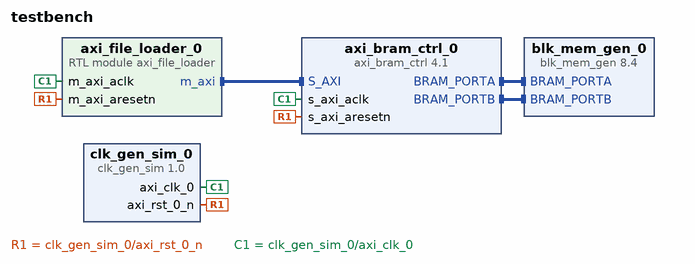
[diagram p0: block diagram of the top level]
# Vivado block design testbench, xc7vx690tffg1927-2, Vivado 2019.1
create_bd_design testbench

create_bd_cell -type ip -vlnv xilinx.com:ip:clk_gen_sim:1.0 clk_gen_sim_0
create_bd_cell -type ip -vlnv xilinx.com:ip:axi_bram_ctrl:4.1 axi_bram_ctrl_0
set_property -dict {CONFIG.DATA_WIDTH 256} [get_bd_cells axi_bram_ctrl_0]
create_bd_cell -type ip -vlnv xilinx.com:ip:blk_mem_gen:8.4 blk_mem_gen_0
set_property -dict [list \
  CONFIG.Enable_B Use_ENB_Pin \
  CONFIG.Memory_Type True_Dual_Port_RAM \
  CONFIG.Port_B_Clock 100 \
  CONFIG.Port_B_Enable_Rate 100 \
  CONFIG.Port_B_Write_Rate 50 \
  CONFIG.Use_RSTB_Pin true \
] [get_bd_cells blk_mem_gen_0]
create_bd_cell -type module -reference axi_file_loader axi_file_loader_0

# ---- connections ----

connect_bd_intf_net [get_bd_intf_pins axi_bram_ctrl_0/BRAM_PORTA] [get_bd_intf_pins blk_mem_gen_0/BRAM_PORTA]
connect_bd_intf_net [get_bd_intf_pins axi_file_loader_0/m_axi] [get_bd_intf_pins axi_bram_ctrl_0/S_AXI]
connect_bd_intf_net [get_bd_intf_pins axi_bram_ctrl_0/BRAM_PORTB] [get_bd_intf_pins blk_mem_gen_0/BRAM_PORTB]
connect_bd_net [get_bd_pins clk_gen_sim_0/axi_rst_0_n] [get_bd_pins axi_bram_ctrl_0/s_axi_aresetn] [get_bd_pins axi_file_loader_0/m_axi_aresetn]
connect_bd_net [get_bd_pins clk_gen_sim_0/axi_clk_0] [get_bd_pins axi_bram_ctrl_0/s_axi_aclk] [get_bd_pins axi_file_loader_0/m_axi_aclk]

# ---- address map ----
assign_bd_address -offset 0x0000 -range 64K -target_address_space [get_bd_addr_spaces axi_file_loader_0/m_axi] [get_bd_addr_segs axi_bram_ctrl_0/S_AXI/Mem0]

validate_bd_design
save_bd_design
